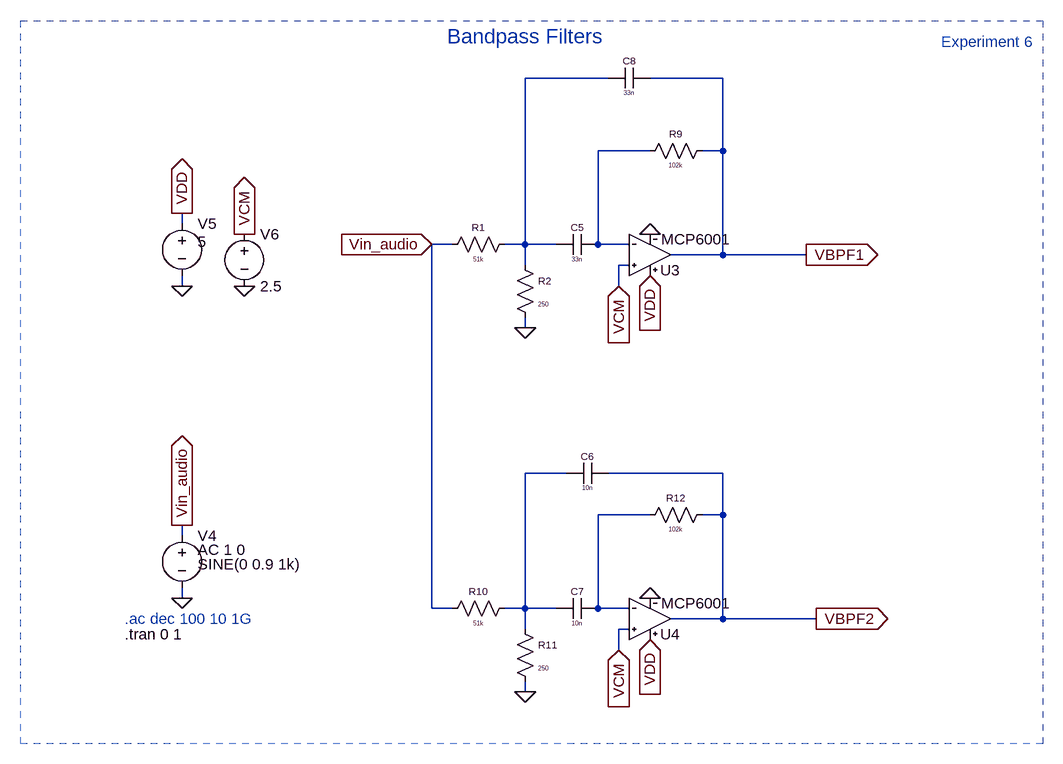
[diagram p0: schematic Experiment 6 - Bandpass filter.asc]
Experiment 6 - Bandpass filter.asc, the LTspice schematic file:
Version 4
SHEET 1 1684 2084
WIRE 768 1056 640 1056
WIRE 944 1056 832 1056
WIRE 832 1168 752 1168
WIRE 944 1168 944 1056
WIRE 944 1168 912 1168
WIRE 112 1280 112 1264
WIRE 528 1312 496 1312
WIRE 640 1312 640 1056
WIRE 640 1312 608 1312
WIRE 688 1312 640 1312
WIRE 752 1312 752 1168
WIRE 800 1312 752 1312
WIRE 944 1328 944 1168
WIRE 944 1328 864 1328
WIRE 1072 1328 944 1328
WIRE 640 1344 640 1312
WIRE 800 1344 784 1344
WIRE 112 1376 112 1360
WIRE 784 1376 784 1344
WIRE 640 1440 640 1424
WIRE 704 1664 640 1664
WIRE 944 1664 768 1664
WIRE 832 1728 752 1728
WIRE 944 1728 944 1664
WIRE 944 1728 912 1728
WIRE 112 1760 112 1744
WIRE 112 1856 112 1840
WIRE 496 1872 496 1312
WIRE 528 1872 496 1872
WIRE 640 1872 640 1664
WIRE 640 1872 608 1872
WIRE 688 1872 640 1872
WIRE 752 1872 752 1728
WIRE 800 1872 752 1872
WIRE 944 1888 944 1728
WIRE 944 1888 864 1888
WIRE 1088 1888 944 1888
WIRE 640 1904 640 1872
WIRE 800 1904 784 1904
WIRE 784 1936 784 1904
WIRE 640 2000 640 1984
FLAG 112 1744 Vin_audio
IOPIN 112 1744 Out
FLAG 112 1856 0
FLAG 112 1376 0
FLAG 112 1264 VDD
IOPIN 112 1264 Out
FLAG 640 1440 0
FLAG 496 1312 Vin_audio
IOPIN 496 1312 In
FLAG 640 2000 0
FLAG 784 1376 VCM
IOPIN 784 1376 In
FLAG 784 1936 VCM
IOPIN 784 1936 In
FLAG 1088 1888 VBPF2
IOPIN 1088 1888 Out
FLAG 1072 1328 VBPF1
IOPIN 1072 1328 Out
FLAG 832 1856 0
FLAG 832 1296 0
FLAG 832 1920 VDD
IOPIN 832 1920 In
FLAG 832 1360 VDD
IOPIN 832 1360 In
FLAG 208 1376 0
FLAG 208 1296 VCM
IOPIN 208 1296 Out
SYMBOL MCP6001 832 1328 M180
SYMATTR InstName U3
SYMBOL MCP6001 832 1888 M180
SYMATTR InstName U4
SYMBOL voltage 112 1744 R0
WINDOW 3 24 60 Left 2
WINDOW 123 24 38 Left 2
SYMATTR Value SINE(0 0.9 1k)
SYMATTR Value2 AC 1 0
SYMATTR InstName V4
SYMBOL voltage 112 1264 R0
WINDOW 3 24 44 Left 2
SYMATTR Value 5
SYMATTR InstName V5
SYMBOL res 624 1296 R90
WINDOW 0 0 56 VBottom 1
WINDOW 3 32 56 VTop 0
SYMATTR InstName R1
SYMATTR Value 51k
SYMBOL res 624 1328 R0
WINDOW 0 36 40 Left 1
WINDOW 3 36 76 Left 0
SYMATTR InstName R2
SYMATTR Value 250
SYMBOL res 816 1184 R270
WINDOW 0 32 56 VTop 1
WINDOW 3 0 56 VBottom 0
SYMATTR InstName R9
SYMATTR Value 102k
SYMBOL cap 752 1296 R90
WINDOW 0 0 32 VBottom 1
WINDOW 3 32 32 VTop 0
SYMATTR InstName C5
SYMATTR Value 33n
SYMBOL res 624 1856 R90
WINDOW 0 0 56 VBottom 1
WINDOW 3 32 56 VTop 0
SYMATTR InstName R10
SYMATTR Value 51k
SYMBOL res 624 1888 R0
WINDOW 0 36 40 Left 1
WINDOW 3 36 76 Left 0
SYMATTR InstName R11
SYMATTR Value 250
SYMBOL res 816 1744 R270
WINDOW 0 32 56 VTop 1
WINDOW 3 0 56 VBottom 0
SYMATTR InstName R12
SYMATTR Value 102k
SYMBOL cap 768 1648 R90
WINDOW 0 0 32 VBottom 1
WINDOW 3 32 32 VTop 0
SYMATTR InstName C6
SYMATTR Value 10n
SYMBOL cap 752 1856 R90
WINDOW 0 0 32 VBottom 1
WINDOW 3 32 32 VTop 0
SYMATTR InstName C7
SYMATTR Value 10n
SYMBOL cap 832 1040 R90
WINDOW 0 0 32 VBottom 1
WINDOW 3 32 32 VTop 0
SYMATTR InstName C8
SYMATTR Value 33n
SYMBOL Voltage 208 1280 R0
SYMATTR InstName V6
SYMATTR Value 2.5
TEXT 24 1888 Left 2 ;.ac dec 100 10 1G
TEXT 24 1912 Left 2 !.tran 0 1
TEXT 520 992 Left 3 ;Bandpass Filters
TEXT 1280 1000 Left 2 ;Experiment 6
RECTANGLE Normal -136 968 1436 2080 2

The netlist it stands for:
* Experiment 6 - Bandpass filter.asc
XU3 VCM N002 VDD 0 VBPF1 MCP6001
XU4 VCM N004 VDD 0 VBPF2 MCP6001
V4 Vin_audio 0 SINE(0 0.9 1k) AC 1 0
V5 VDD 0 5
R1 N001 Vin_audio 51k
R2 N001 0 250
R9 N002 VBPF1 102k
C5 N002 N001 33n
R10 N003 Vin_audio 51k
R11 N003 0 250
R12 N004 VBPF2 102k
C6 VBPF2 N003 10n
C7 N004 N003 10n
C8 VBPF1 N001 33n
V6 VCM 0 2.5
* .ac dec 100 10 1G
.tran 0 1
* Bandpass Filters
* Experiment 6
.lib ./MCP6001.lib
.backanno
.end